# EasyEDA schematic Powder'O'Matic_Stepper_TMC2208_V1.json
TITLE: Powder'O'Matic Step; REV: 1.0; Date: 2018-11-28; Sheet: 1/1; Drawn By: Harald Klein
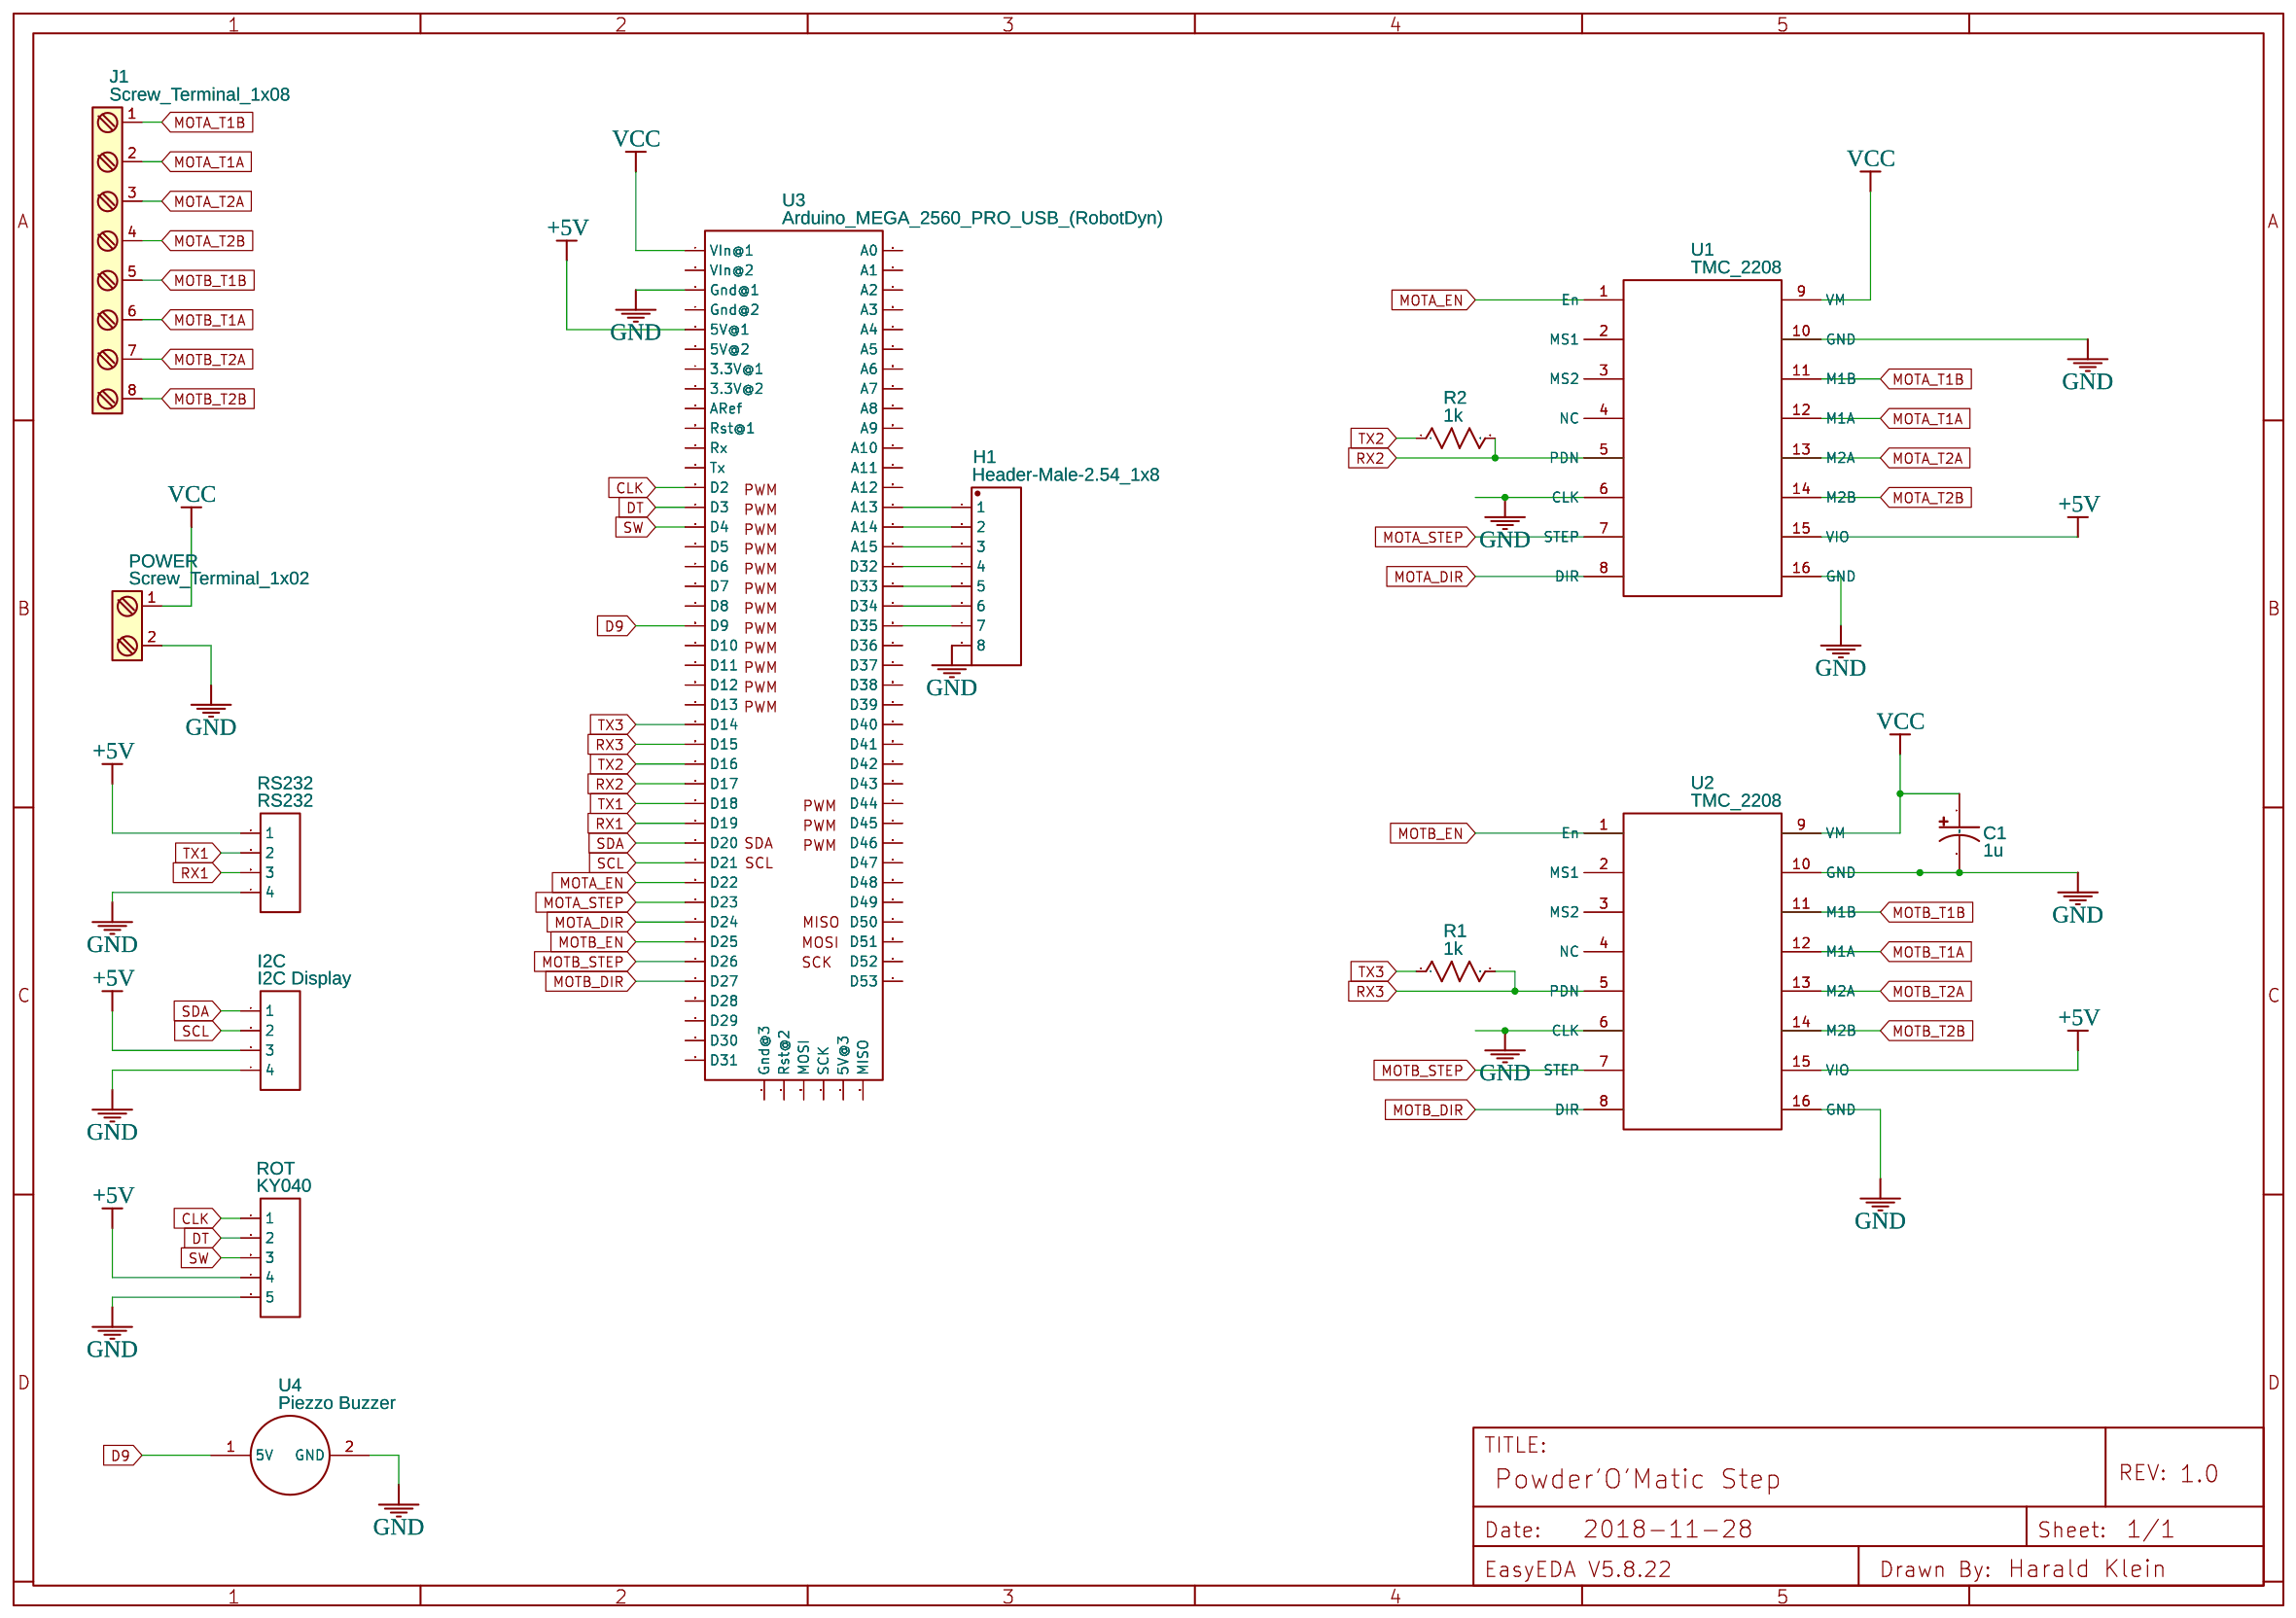
[diagram p0: schematic sheet]

## Parts
C1  1u  [CAP-D3.0XF1.5]
H1  Header-Male-2.54_1x8  [210S-1X8P]
I2C  I2C Display  [HDR-4X1/2.54]
J1  Screw_Terminal_1x08  [SCREWTERMINAL-3.5MM-8]
POWER  Screw_Terminal_1x02  [SCREWTERMINAL-3.5MM-2]
R1  1k  [AXIAL-0.3]
R2  1k  [AXIAL-0.3]
ROT  KY040  [HDR-5X1/2.54]
RS232  RS232  [HDR-4X1/2.54]
U1  TMC_2208  [TMC 2208]
U2  TMC_2208  [TMC 2208]
U3  Arduino_MEGA_2560_PRO_USB_(RobotDyn)  [ARDUINO_MEGA_2560_PRO_USB(ROBOTDYN)]
U4  Piezzo Buzzer  [PIEZOO BUZZER]

## Library data of the parts
C1 = Cap_Electrolytic(TH)_D3.0XF1.5_US: Manufacturer Part: ?
H1 = -: Supplier Part: C124381; Supplier: LCSC; Manufacturer: Ckmtw; Manufacturer Part: 210S-1*8P L=11.6MMGold-plated black; Contributor: LCSC
I2C RS232 = -: Supplier Part: C124413; Supplier: LCSC; Manufacturer: ReliaPro; Manufacturer Part: Header-Female-2.54_1x4
J1 POWER = -: Contributor: KiCAD; license: https://www.gnu.org/licenses/lgpl-2.1.html; Manufacturer Part: ?
R1 R2 = Res_AXIAL-0.3(1/8W)_US: Manufacturer Part: ?
ROT = -: Supplier Part: C50950; Supplier: LCSC; Manufacturer: BOOMELE; Manufacturer Part: 2.54mm 1*5p Female header; image: //image.lceda.cn/szlcsc/C50950.jpg
U1 U2 = -: Manufacturer Part: ?; Contributor: raul_tgn_81
U3 = -: Manufacturer Part: ARDUINO MEGA 2560 PRO EMBED (RobotDyn); Contributor: capsule5000
U4 = -: Manufacturer Part: New SchematicLib; Contributor: NiklasC; link: https://robotdyn.com/mega-2560-pro-embed-ch340g-atmega2560-16au.html

## Nets
+5V: I2C.3 ROT.4 RS232.1 U1.15(VIO) U2.15(VIO) U3.5(5V@1)
GND: C1.2 H1.8 I2C.4 POWER.2 ROT.5 RS232.4 U1.6(CLK) U1.10(GND) U1.16(GND) U2.6(CLK) U2.10(GND) U2.16(GND) U3.3(Gnd@1) U4.2(GND)
VCC: C1.1 POWER.1 U1.9(VM) U2.9(VM) U3.1(VIn@1)
CLK: ROT.1 U3.13(D2)
D9: U3.20(D9) U4.1(5V)
DT: ROT.2 U3.14(D3)
MOTA_DIR: U1.8(DIR) U3.35(D24)
MOTA_EN: U1.1(En) U3.33(D22)
MOTA_STEP: U1.7(STEP) U3.34(D23)
MOTA_T1A: J1.2 U1.12(M1A)
MOTA_T1B: J1.1 U1.11(M1B)
MOTA_T2A: J1.3 U1.13(M2A)
MOTA_T2B: J1.4 U1.14(M2B)
MOTB_DIR: U2.8(DIR) U3.38(D27)
MOTB_EN: U2.1(En) U3.36(D25)
MOTB_STEP: U2.7(STEP) U3.37(D26)
MOTB_T1A: J1.6 U2.12(M1A)
MOTB_T1B: J1.5 U2.11(M1B)
MOTB_T2A: J1.7 U2.13(M2A)
MOTB_T2B: J1.8 U2.14(M2B)
RX1: RS232.3 U3.30(D19)
RX2: R2.2 U1.5(PDN) U3.28(D17)
RX3: R1.2 U2.5(PDN) U3.26(D15)
SCL: I2C.2 U3.32(D21)
SDA: I2C.1 U3.31(D20)
SW: ROT.3 U3.15(D4)
TX1: RS232.2 U3.29(D18)
TX2: R2.1 U3.27(D16)
TX3: R1.1 U3.25(D14)
Net-(H1-1): H1.1 U3.56(A13)
Net-(H1-2): H1.2 U3.57(A14)
Net-(H1-3): H1.3 U3.58(A15)
Net-(H1-4): H1.4 U3.59(D32)
Net-(H1-5): H1.5 U3.60(D33)
Net-(H1-6): H1.6 U3.61(D34)
Net-(H1-7): H1.7 U3.62(D35)

Not connected (* = marked no-connect by the designer): U1 2(MS1) 3(MS2) 4(NC); U2 2(MS1) 3(MS2) 4(NC); U3 2(VIn@2) 4(Gnd@2) 6(5V@2) 7(3.3V@1) 8(3.3V@2) 9(ARef) 10(Rst@1) 11(Rx) 12(Tx) 16(D5) 17(D6) 18(D7) 19(D8) 21(D10) 22(D11) 23(D12) 24(D13) 39(D28) 40(D29) 41(D30) 42(D31) 43(A0) 44(A1) 45(A2) 46(A3) 47(A4) 48(A5) 49(A6) 50(A7) 51(A8) 52(A9) 53(A10) 54(A11) 55(A12) 63(D36) 64(D37) 65(D38) 66(D39) 67(D40) 68(D41) 69(D42) 70(D43) 71(D44) 72(D45) 73(D46) 74(D47) 75(D48) 76(D49) 77(D50) 78(D51) 79(D52) 80(D53) 81(5V@3) 82(MISO) 83(MOSI) 84(SCK) 85(Gnd@3) 86(Rst@2)
